# EAGLE design RGB_LED_Band_Treiber (EAGLE 4.16)

## Sheet 1 of 3
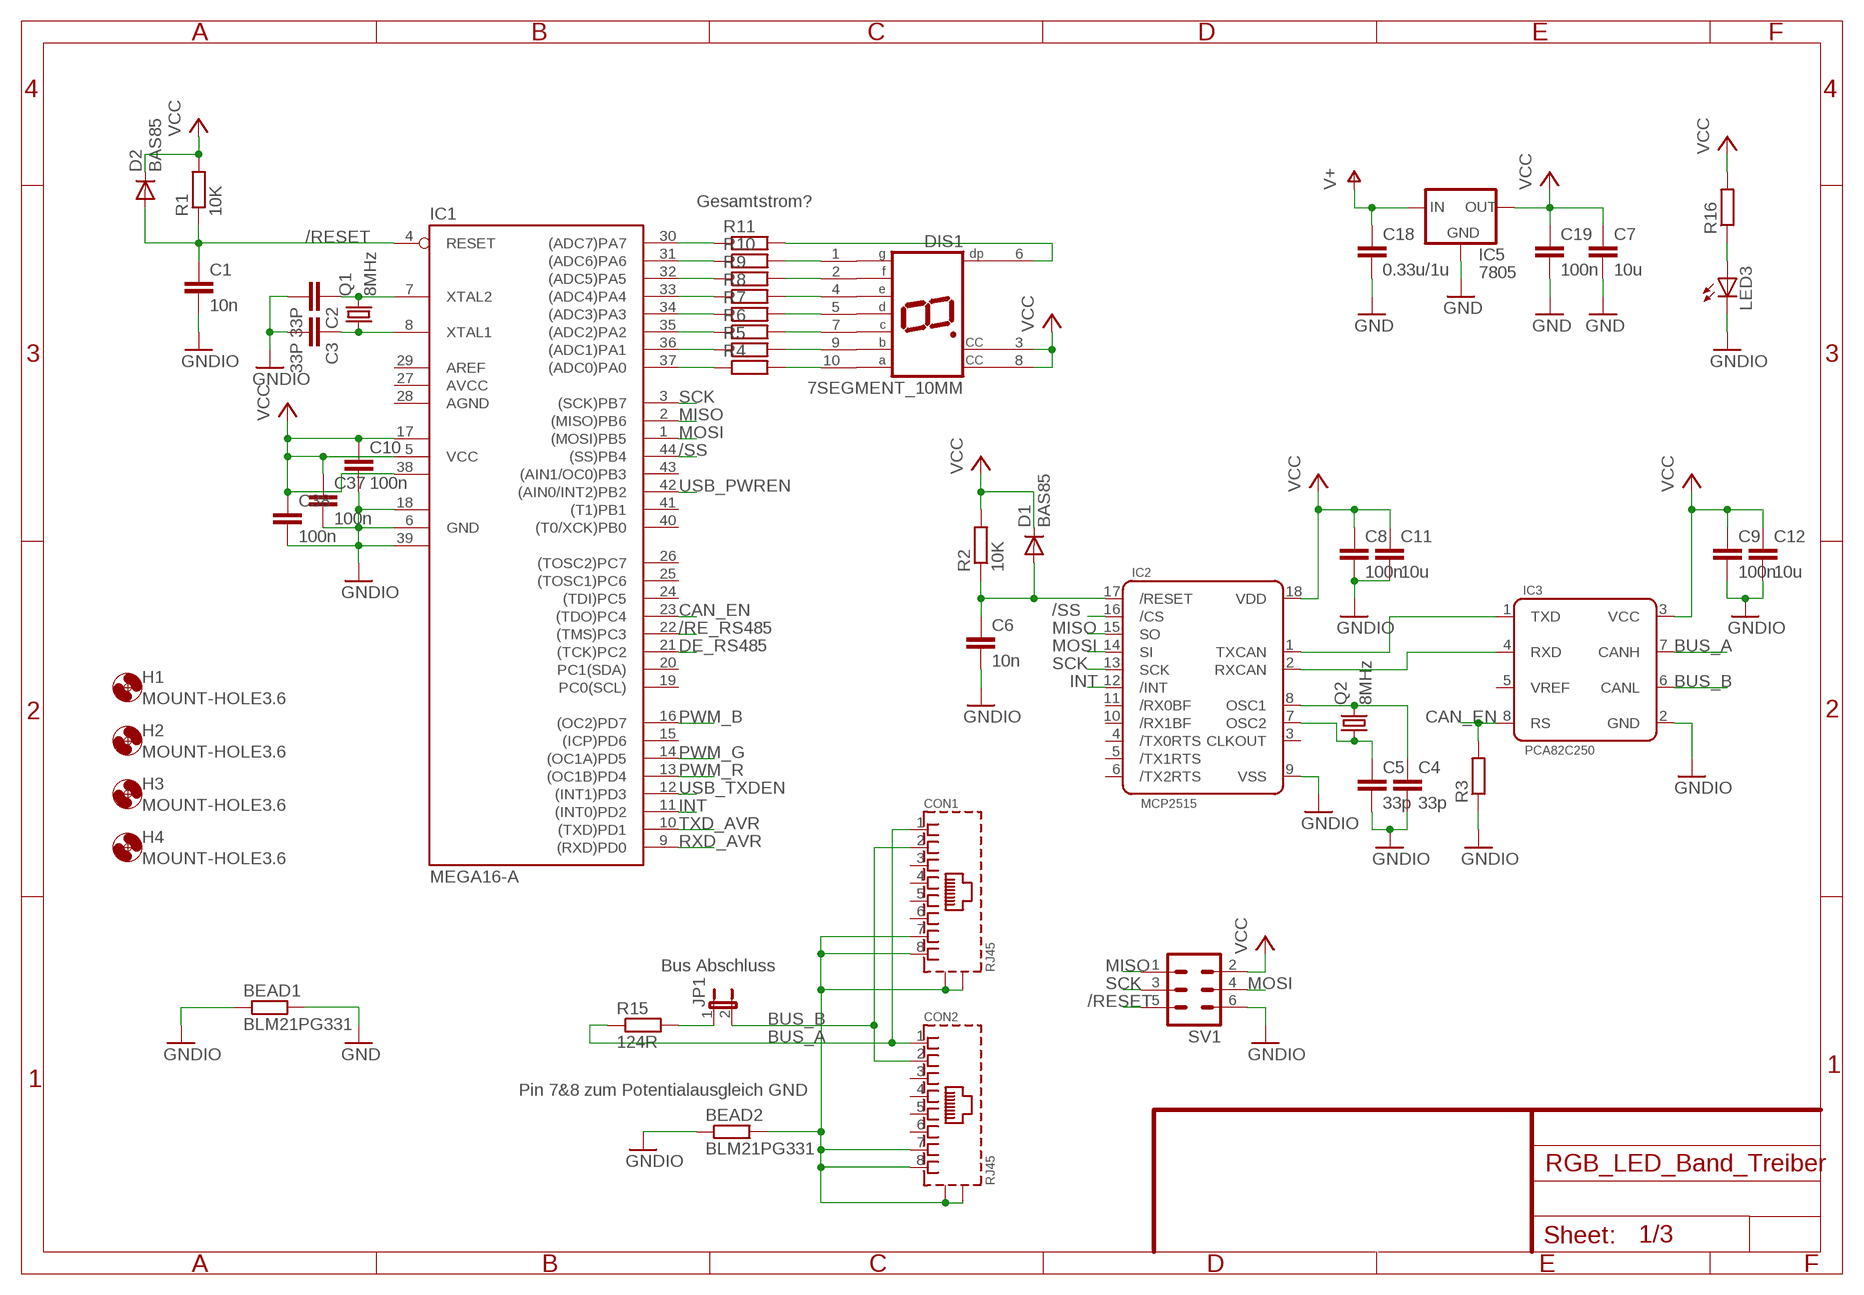
[diagram p0: schematic, sheet 1]

### Parts
BEAD1  BLM21PG331  R-EU_R0805  [R0805]
BEAD2  BLM21PG331  R-EU_R0805  [R0805]
C1  10n  C-EUC0805  [C0805]
C2  33P  C-EUC0805  [C0805]
C3  33P  C-EUC0805  [C0805]
C4  33p  C-EUC0805  [C0805]
C5  33p  C-EUC0805  [C0805]
C6  10n  C-EUC0805  [C0805]
C7  10u  C-EUC0805  [C0805]
C8  100n  C-EUC0805  [C0805]
C9  100n  C-EUC0805  [C0805]
C10  100n  C-EUC0805  [C0805]
C11  10u  C-EUC0805  [C0805]
C12  10u  C-EUC0805  [C0805]
C18  0.33u/1u  C-EUC0805  [C0805]
C19  100n  C-EUC0805  [C0805]
C37  100n  C-EUC0805  [C0805]
C38  100n  C-EUC0805  [C0805]
CON1  RJ45  [RJ45]
CON2  RJ45  [RJ45]
D1  BAS85  DIODE-SOD80C  [SOD80C]
D2  BAS85  DIODE-SOD80C  [SOD80C]
DIS1  7SEGMENT_10MM  [HDSP-E]
H1  MOUNT-HOLE3.6  [3,6]
H2  MOUNT-HOLE3.6  [3,6]
H3  MOUNT-HOLE3.6  [3,6]
H4  MOUNT-HOLE3.6  [3,6]
IC1  MEGA16-A  [TQFP44]
IC2  MCP2515  [SO18W]
IC3  PCA82C250  [SO08]
IC5  7805  78XXL  [78XXL]
JP1  JP1E  [JP1]
LED3  LEDCHIP-LED0805  [CHIP-LED0805]
Q1  8MHz  CRYTALHC49S  [HC49/S]
Q2  8MHz  CRYTALHC49S  [HC49/S]
R1  10K  R-EU_R0805  [R0805]
R2  10K  R-EU_R0805  [R0805]
R3  R-EU_R0805  [R0805]
R4  R-EU_R0805  [R0805]
R5  R-EU_R0805  [R0805]
R6  R-EU_R0805  [R0805]
R7  R-EU_R0805  [R0805]
R8  R-EU_R0805  [R0805]
R9  R-EU_R0805  [R0805]
R10  R-EU_R0805  [R0805]
R11  R-EU_R0805  [R0805]
R15  124R  R-EU_R0805  [R0805]
R16  R-EU_R0805  [R0805]
SV1  ML6  [ML6]

### Nets
/RE_RS485: IC1.22((TMS)PC3) ; also sheet 2
/RESET: C1.1 D2.A IC1.4(RESET) R1.1 SV1.5
/SS: IC1.44((SS)PB4) IC2.16(/CS)
BUS_A: CON1.1 CON2.1 IC3.7(CANH) R15.1 ; also sheet 2
BUS_B: CON1.2 CON2.2 IC3.6(CANL) JP1.2 ; also sheet 2
CAN_EN: IC1.23((TDO)PC4) IC3.8(RS) R3.2
DE_RS485: IC1.21((TCK)PC2) ; also sheet 2
GND: BEAD1.2 C7.2 C18.2 C19.2 IC5.GND ; also sheet 3
GNDIO: BEAD1.1 BEAD2.1 C1.2 C2.2 C3.2 C4.2 C5.2 C6.2 C8.2 C9.2 C10.2 C11.2 C12.2 C37.2 C38.2 IC1.6(GND) IC1.18(GND1) IC1.39(GND2) IC2.9(VSS) IC3.2(GND) LED3.C R3.1 SV1.6 ; also sheet 2
INT: IC1.11((INT0)PD2) IC2.12(/INT)
MISO: IC1.2((MISO)PB6) IC2.15(SO) SV1.1
MOSI: IC1.1((MOSI)PB5) IC2.14(SI) SV1.4
N$1: C3.1 IC1.8(XTAL1) Q1.1
N$2: C2.1 IC1.7(XTAL2) Q1.2
N$3: C6.1 D1.A IC2.17(/RESET) R2.1
N$4: C4.1 IC2.8(OSC1) Q2.2
N$5: C5.1 IC2.7(OSC2) Q2.1
N$6: IC1.37((ADC0)PA0) R4.1
N$7: IC2.1(TXCAN) IC3.1(TXD)
N$8: IC2.2(RXCAN) IC3.4(RXD)
N$10: IC1.36((ADC1)PA1) R5.1
N$11: IC1.35((ADC2)PA2) R6.1
N$12: IC1.34((ADC3)PA3) R7.1
N$13: IC1.33((ADC4)PA4) R8.1
N$14: IC1.32((ADC5)PA5) R9.1
N$15: IC1.31((ADC6)PA6) R10.1
N$16: IC1.30((ADC7)PA7) R11.1
N$17: DIS1.10(A) R4.2
N$18: DIS1.9(B) R5.2
N$19: DIS1.7(C) R6.2
N$20: DIS1.5(D) R7.2
N$21: DIS1.4(E) R8.2
N$22: DIS1.2(F) R9.2
N$23: DIS1.1(G) R10.2
N$24: DIS1.6(DP) R11.2
N$27: JP1.1 R15.2
N$37: LED3.A R16.1
N$38: BEAD2.2 CON1.7 CON1.8 CON1.SHIELD1(GND1) CON1.SHILD2(GND2) CON2.7 CON2.8 CON2.SHIELD1(GND1) CON2.SHILD2(GND2)
PWM_B: IC1.16((OC2)PD7) ; also sheet 3
PWM_G: IC1.14((OC1A)PD5) ; also sheet 3
PWM_R: IC1.13((OC1B)PD4) ; also sheet 3
RXD_AVR: IC1.9((RXD)PD0) ; also sheet 2
SCK: IC1.3((SCK)PB7) IC2.13(SCK) SV1.3
TXD_AVR: IC1.10((TXD)PD1) ; also sheet 2
USB_PWREN: IC1.42((AIN0/INT2)PB2) ; also sheet 2
USB_TXDEN: IC1.12((INT1)PD3) ; also sheet 2
V+: C18.1 IC5.IN ; also sheet 3
VCC: C7.1 C8.1 C9.1 C10.1 C11.1 C12.1 C19.1 C37.1 C38.1 D1.C D2.C DIS1.3(CC) DIS1.8(CC) IC1.5(VCC) IC1.17(VCC1) IC1.38(VCC2) IC2.18(VDD) IC3.3(VCC) IC5.OUT R1.2 R2.2 R16.2 SV1.2 ; also sheet 2
Unconnected: CON1.3 CON1.4 CON1.5 CON1.6 CON2.3 CON2.4 CON2.5 CON2.6 IC1.15((ICP)PD6) IC1.19(PC0(SCL)) IC1.20(PC1(SDA)) IC1.24((TDI)PC5) IC1.25((TOSC1)PC6) IC1.26((TOSC2)PC7) IC1.40((T0/XCK)PB0) IC1.41((T1)PB1) IC1.43((AIN1/OC0)PB3) IC2.3(CLKOUT) IC2.4(/TX0RTS) IC2.5(/TX1RTS) IC2.6(/TX2RTS) IC2.10(/RX1BF) IC2.11(/RX0BF) IC3.5(VREF)

### Notes on the sheet
- Gesamtstrom?
- Bus Abschluss
- Pin 7&8 zum Potentialausgleich GND

## Sheet 2 of 3
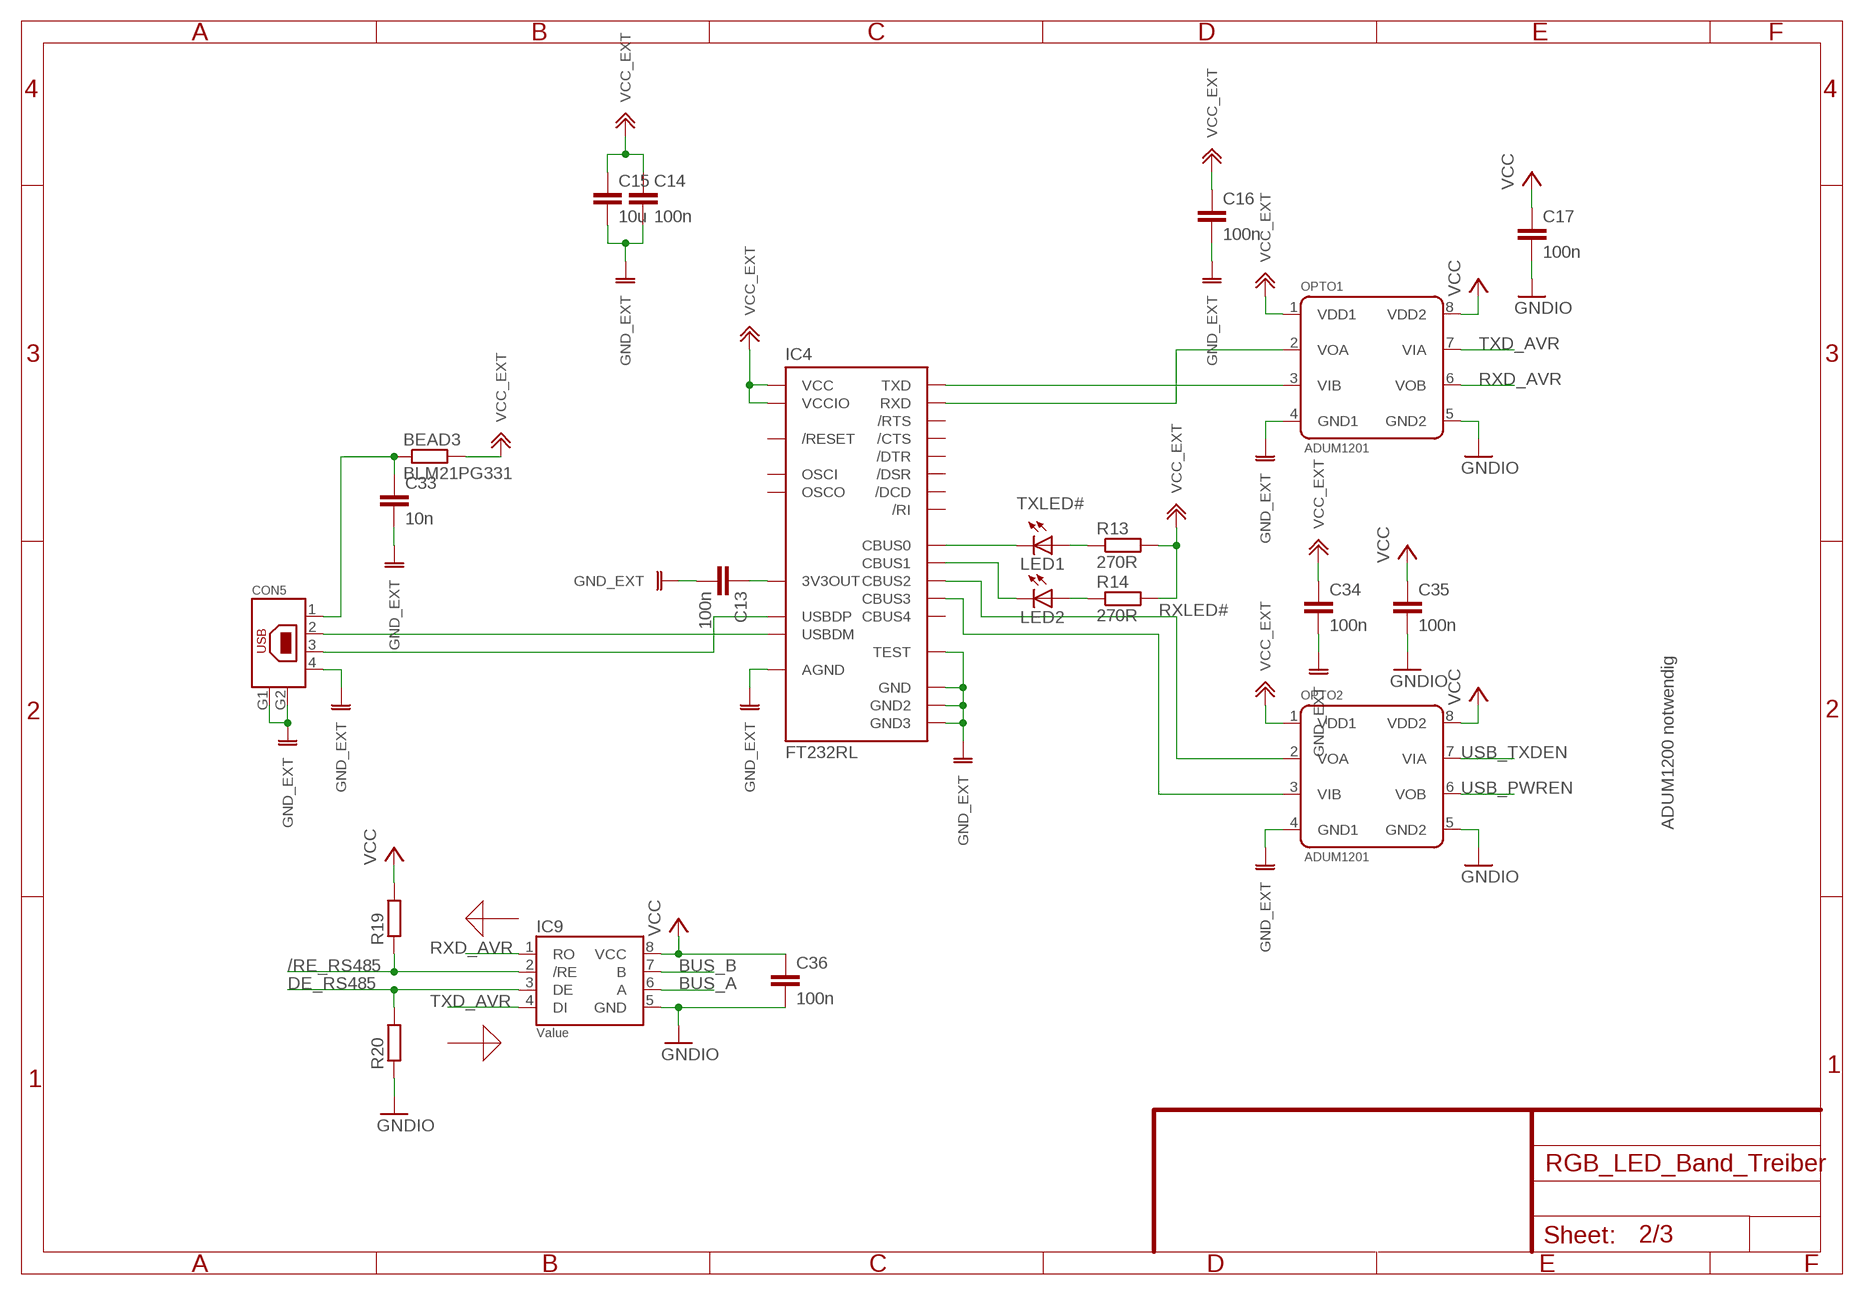
[diagram p1: schematic, sheet 2]

### Parts
BEAD3  BLM21PG331  R-EU_R0805  [R0805]
C13  100n  C-EUC0805  [C0805]
C14  100n  C-EUC0805  [C0805]
C15  10u  C-EUC0805  [C0805]
C16  100n  C-EUC0805  [C0805]
C17  100n  C-EUC0805  [C0805]
C33  10n  C-EUC0805  [C0805]
C34  100n  C-EUC0805  [C0805]
C35  100n  C-EUC0805  [C0805]
C36  100n  C-EUC0805  [C0805]
CON5  USB_TYPB_PCB  [USB_LUMBERG_241102]
IC4  FT232RL  [SSOP28]
IC9  LT1785  [SO08]
LED1  LEDCHIPLED_0805  [CHIPLED_0805]
LED2  LEDCHIPLED_0805  [CHIPLED_0805]
OPTO1  ADUM1201  [SO08]
OPTO2  ADUM1201  [SO08]
R13  270R  R-EU_R0805  [R0805]
R14  270R  R-EU_R0805  [R0805]
R19  R-EU_R0805  [R0805]
R20  R-EU_R0805  [R0805]

### Nets
/RE_RS485: IC9.2(/RE) R19.1 ; also sheet 1
BUS_A: IC9.6(A) ; also sheet 1
BUS_B: IC9.7(B) ; also sheet 1
DE_RS485: IC9.3(DE) R20.2 ; also sheet 1
GND_EXT: C13.2 C14.2 C15.2 C16.2 C33.2 C34.2 CON5.4 CON5.G1 CON5.G2 IC4.P$7(GND) IC4.P$18(GND2) IC4.P$21(GND3) IC4.P$25(AGND) IC4.P$26(TEST) OPTO1.4(GND1) OPTO2.4(GND1)
GNDIO: C17.2 C35.2 C36.2 IC9.5(GND) OPTO1.5(GND2) OPTO2.5(GND2) R20.1 ; also sheet 1
N$9: BEAD3.1 C33.1 CON5.1
N$25: CON5.2 IC4.P$16(USBDM)
N$26: C13.1 IC4.P$17(3V3OUT)
N$29: LED1.A R13.1
N$30: LED2.A R14.1
N$31: IC4.P$23(CBUS0) LED1.C
N$32: IC4.P$22(CBUS1) LED2.C
N$33: IC4.P$1(TXD) OPTO1.3(VIB)
N$34: IC4.P$5(RXD) OPTO1.2(VOA)
N$40: CON5.3 IC4.P$15(USBDP)
N$42: IC4.P$13(CBUS2) OPTO2.2(VOA)
N$46: IC4.P$14(CBUS3) OPTO2.3(VIB)
RXD_AVR: IC9.1(RO) OPTO1.6(VOB) ; also sheet 1
TXD_AVR: IC9.4(DI) OPTO1.7(VIA) ; also sheet 1
USB_PWREN: OPTO2.6(VOB) ; also sheet 1
USB_TXDEN: OPTO2.7(VIA) ; also sheet 1
VCC: C17.1 C35.1 C36.1 IC9.8(VCC) OPTO1.8(VDD2) OPTO2.8(VDD2) R19.2 ; also sheet 1
VCC_EXT: BEAD3.2 C14.1 C15.1 C16.1 C34.1 IC4.P$4(VCCIO) IC4.P$20(VCC) OPTO1.1(VDD1) OPTO2.1(VDD1) R13.2 R14.2
Unconnected: IC4.P$2(/DTR) IC4.P$3(/RTS) IC4.P$6(/RI) IC4.P$9(/DSR) IC4.P$10(/DCD) IC4.P$11(/CTS) IC4.P$12(CBUS4) IC4.P$19(/RESET) IC4.P$27(OSCI) IC4.P$28(OSCO)

### Notes on the sheet
- TXLED#
- RXLED#
- ADUM1200 notwendig

## Sheet 3 of 3
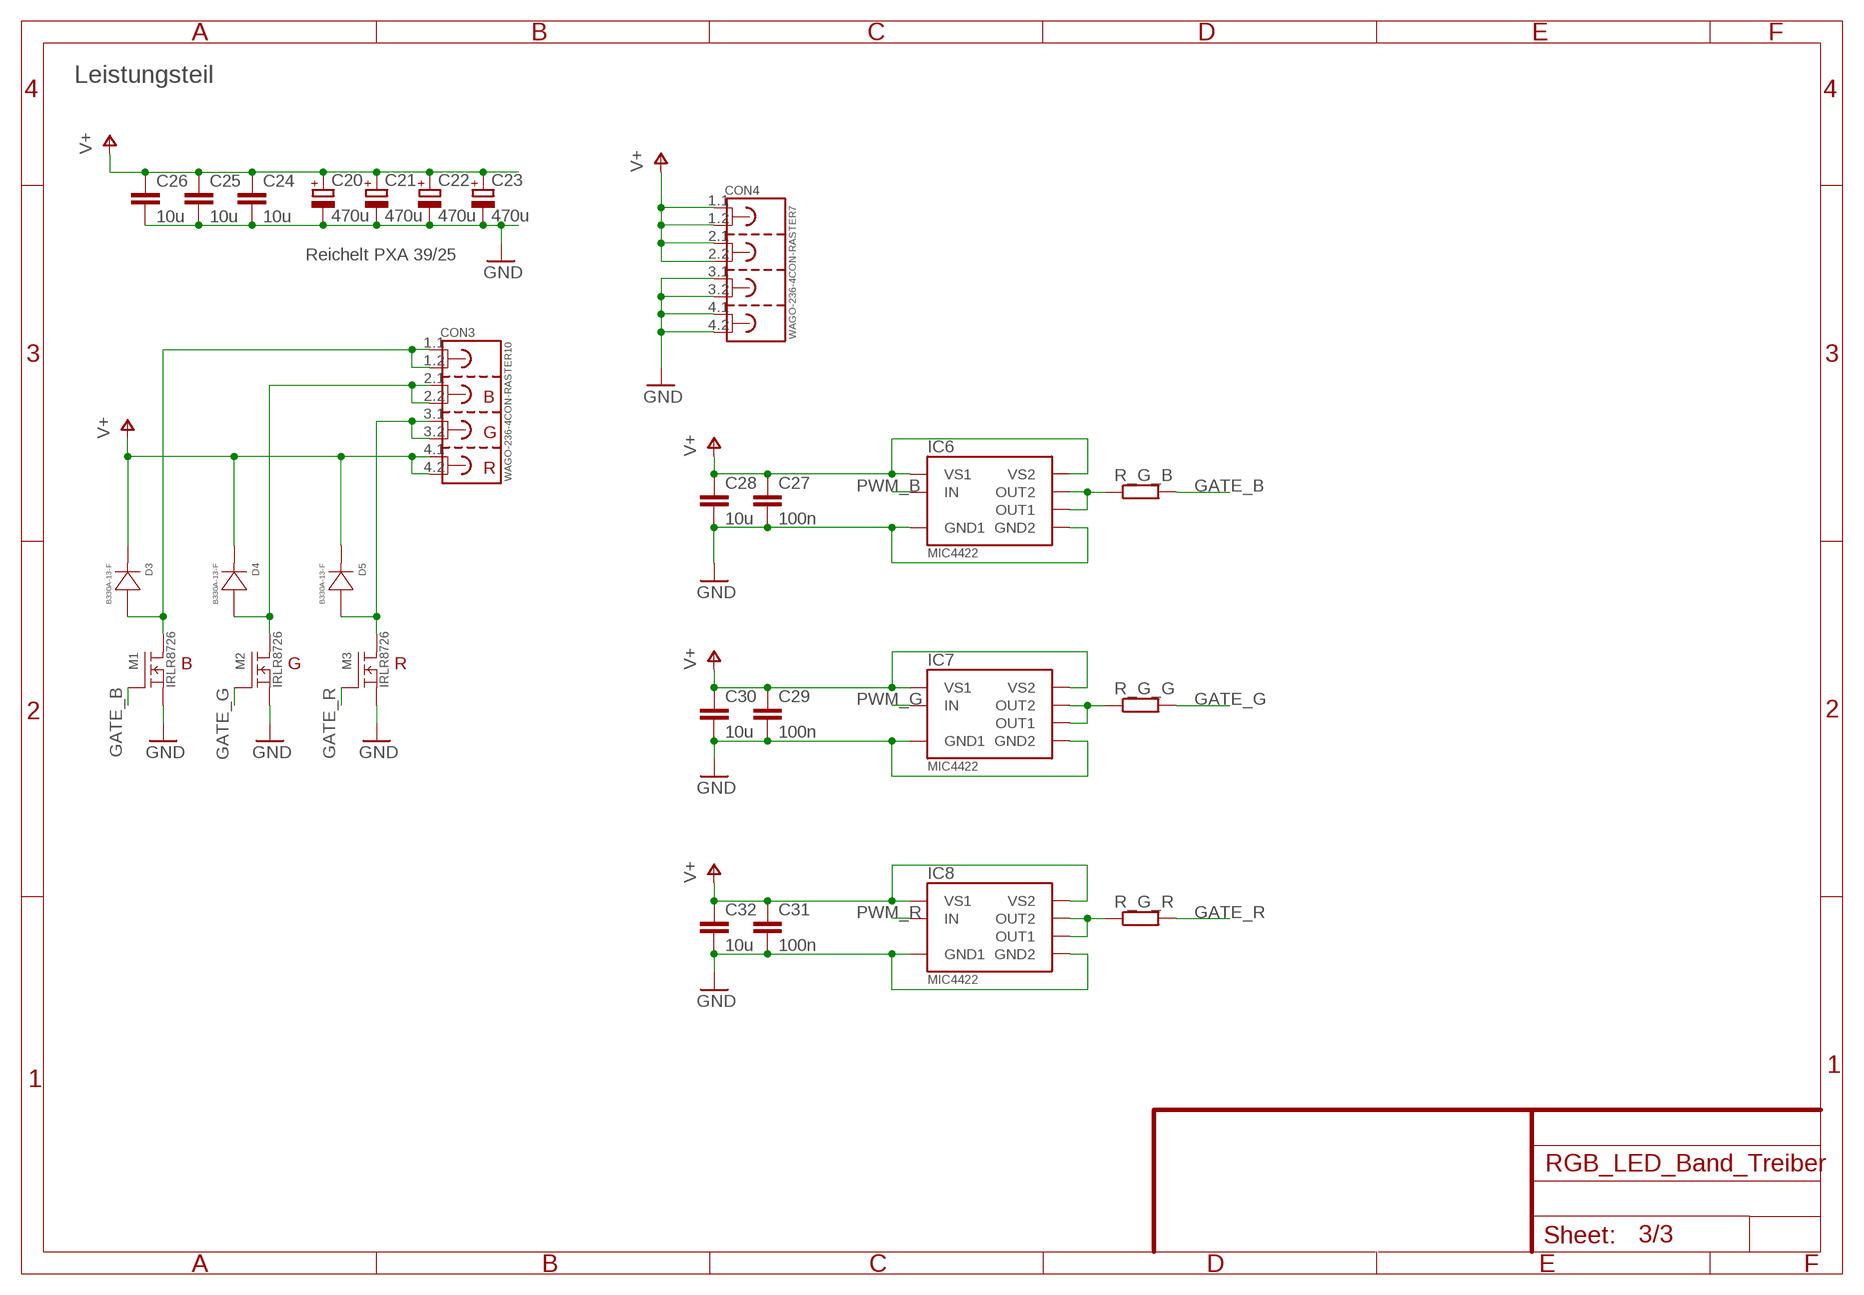
[diagram p2: schematic, sheet 3]

### Parts
C20  470u  CPOL-EUE5-10.5  [E5-10,5]
C21  470u  CPOL-EUE5-10.5  [E5-10,5]
C22  470u  CPOL-EUE5-10.5  [E5-10,5]
C23  470u  CPOL-EUE5-10.5  [E5-10,5]
C24  10u  C-EUC0805  [C0805]
C25  10u  C-EUC0805  [C0805]
C26  10u  C-EUC0805  [C0805]
C27  100n  C-EUC0805  [C0805]
C28  10u  C-EUC0805  [C0805]
C29  100n  C-EUC0805  [C0805]
C30  10u  C-EUC0805  [C0805]
C31  100n  C-EUC0805  [C0805]
C32  10u  C-EUC0805  [C0805]
CON3  WAGO-236-4CON-RASTER10  [WAGO236_10_4]
CON4  WAGO-236-4CON-RASTER7  [WAGO236_7.5_4]
D3  B330A-13-F  [SMA]
D4  B330A-13-F  [SMA]
D5  B330A-13-F  [SMA]
IC6  MIC4422  [SO08]
IC7  MIC4422  [SO08]
IC8  MIC4422  [SO08]
M1  IRLR8726  [D-PAK]
M2  IRLR8726  [D-PAK]
M3  IRLR8726  [D-PAK]
R_G_B  R-EU_R0805  [R0805]
R_G_G  R-EU_R0805  [R0805]
R_G_R  R-EU_R0805  [R0805]

### Nets
GATE_B: M1.G R_G_B.2
GATE_G: M2.G R_G_G.2
GATE_R: M3.G R_G_R.2
GND: C20.- C21.- C22.- C23.- C24.2 C25.2 C26.2 C27.2 C28.2 C29.2 C30.2 C31.2 C32.2 CON4.3.1 CON4.3.2 CON4.4.1 CON4.4.2 IC6.4(GND1) IC6.5(GND2) IC7.4(GND1) IC7.5(GND2) IC8.4(GND1) IC8.5(GND2) M1.S M2.S M3.S ; also sheet 1
N$28: CON3.3.1 CON3.3.2 D5.A M3.D
N$36: CON3.1.1 CON3.1.2 D3.A M1.D
N$43: IC6.6(OUT1) IC6.7(OUT2) R_G_B.1
N$44: IC8.6(OUT1) IC8.7(OUT2) R_G_R.1
N$45: IC7.6(OUT1) IC7.7(OUT2) R_G_G.1
N_B: CON3.2.1 CON3.2.2 D4.A M2.D
PWM_B: IC6.2(IN) ; also sheet 1
PWM_G: IC7.2(IN) ; also sheet 1
PWM_R: IC8.2(IN) ; also sheet 1
V+: C20.+ C21.+ C22.+ C23.+ C24.1 C25.1 C26.1 C27.1 C28.1 C29.1 C30.1 C31.1 C32.1 CON3.4.1 CON3.4.2 CON4.1.1 CON4.1.2 CON4.2.1 CON4.2.2 D3.K D4.K D5.K IC6.1(VS1) IC6.8(VS2) IC7.1(VS1) IC7.8(VS2) IC8.1(VS1) IC8.8(VS2) ; also sheet 1

### Notes on the sheet
- Leistungsteil
- Reichelt PXA 39/25
- B
- G
- R
- B | G | R

## Power pins joined to a net without a drawn wire
AGND: IC1.28(AGND)
AREF: IC1.29(AREF)
AVCC: IC1.27(AVCC)

## Library data of the parts
BEAD1-BEAD3 R1-R11 R13-R16 R19 R20 R_G_B R_G_G R_G_R = rcl:R-EU_: RESISTOR, European symbol
C1-C19 C24-C38 = rcl:C-EU: CAPACITOR, European symbol
C20-C23 = rcl:CPOL-EU: POLARIZED CAPACITOR, European symbol
CON1 CON2 = marcus:RJ45: RJ45 Platinen-Buchse TE Connectivity Farnell Bestellnummer: 2059750 Created by Marcus Knips 9/2012
CON3 CON4 = marcus:WAGO-236-4CON-*
CON5 = marcus:USB_TYPB_PCB: UBS Einbaukupplung Typ B lumberg Artikelnummer: 241102 Created by Marcus Knips 1/2013
D1 D2 = diode:DIODE-: DIODE
D3-D5 = marcus:B330A-13-F: B330A-13-F Schottky Diode DIODES Incorporated Vr = 30V, Id = 3A / 80A pulse Created by Marcus Knips 9/2012
DIS1 = marcus:7SEGMENT_10MM: LED DISPLAY 1-character 7 segment, decimal point right Knigbright SA39-11, SA39-12, SC39-11, SC39-12 Device creaded by Marcus Knips 1/2012
H1-H4 = holes:MOUNT-HOLE: MOUNTING HOLE with drill center marker
IC1 = atmel:MEGA16: MICROCONTROLLER 16 Kbytes FLASH 1 kbytes SRAM 512 bytes EEPROM USART 8-channel 10 bit ADC Source: avr.lbr
IC2 = marcus:MCP2515: MCP2515 CAN Controller Stand-Alone CAN Controller with SPI Interface Microchip Created by Marcus Knips Jan. 2012
IC3 = marcus:PCA82C250: CAN Driver PCA25C250 Philips Creaded by Marcus Knips 1/2012
IC4 = marcus:FT232RL: FT232RL USB USRT FTDI Chip Created by Marcus Knips 1/2012
IC5 = v-reg:78XXL: VOLTAGE REGULATOR
IC6-IC8 = marcus:MIC4422: MIC4422 9A-Peak Low-Side MOSFET Driver micrel&reg Created by Marcus Knips 11/2012
IC9 = marcus:LT1785: LT1785 RS-485 Transceiver Linear Technology Ceated by Marcus Knips 11/2012
JP1 = jumper:JP1E: JUMPER
LED1-LED3 = led:LED: LED OSRAM: - CHIPLED LG R971, LG N971, LY N971, LG Q971, LY Q971, LO R971, LY R971 LH N974, LH R974 LS Q976, LO Q976, LY Q976 LO Q996 - Hyper CHIPLED LW Q18S LB Q993, LB Q99A, LB R99A - SideLED LS A670, LO A670, LY A670, LG A670, LP A670 LB A673, LV A673, LT A673, LW A673 LH A674 LY A675 LS A676, LA A676, LO A676, LY A676, LW A676 LS A679, LY A679, LG A679 - Hyper Micro SIDELED® LS Y876, LA Y876, LO Y876, LY Y876 LT Y87S - SmartLED LW L88C, LW L88S LB L89C, LB L89S, LG L890 LS L89K, LO L89K, LY L89K LS L896, LA L896, LO L896, LY L896 - TOPLED LS T670, LO T670, LY T670, LG T670, LP T670 LSG T670, LSP T670, LSY T670, LOP T670, LYG T670 LG T671, LOG T671, LSG T671 LB T673, LV T673, LT T673, LW T673 LH T674 LS T676, LA T676, LO T676, LY T676, LB T676, LH T676, LSB T676, LW T676 LB T67C, LV T67C, LT T67C, LS T67K, LO T67K, LY T67K, LW E67C LS E67B, LA E67B, LO E67B, LY E67B, LB E67C, LV E67C, LT E67C LW T67C LS T679, LY T679, LG T679 LS T770, LO T770, LY T770, LG T770, LP T770 LB T773, LV T773, LT T773, LW T773 LH T774 LS E675, LA E675, LY E675, LS T675 LS T776, LA T776, LO T776, LY T776, LB T776 LHGB T686 LT T68C, LB T68C - Hyper Mini TOPLED® LB M676 - Mini TOPLED Santana® LG M470 LS M47K, LO M47K, LY M47K Source: http://www.osram.convergy.de/
M1-M3 = marcus:IRLR8726: IRLR8726 HEXFET Power MOSFET International Recifier Vdss = 30V, Id = 86A, Rds(on) = 5,8mOhm Farnell Bestellnummer: 1698305 Created by Marcus Knips 9/2012
OPTO1 OPTO2 = marcus:ADUM1201: ADuM1201 Dual-Canel-Digital Isolator Analog Devices Created by Marcus Knips 1/2012
Q1 Q2 = crystal:CRYTAL: CRYSTAL
SV1 = con-harting-ml:ML6: HARTING

## Board
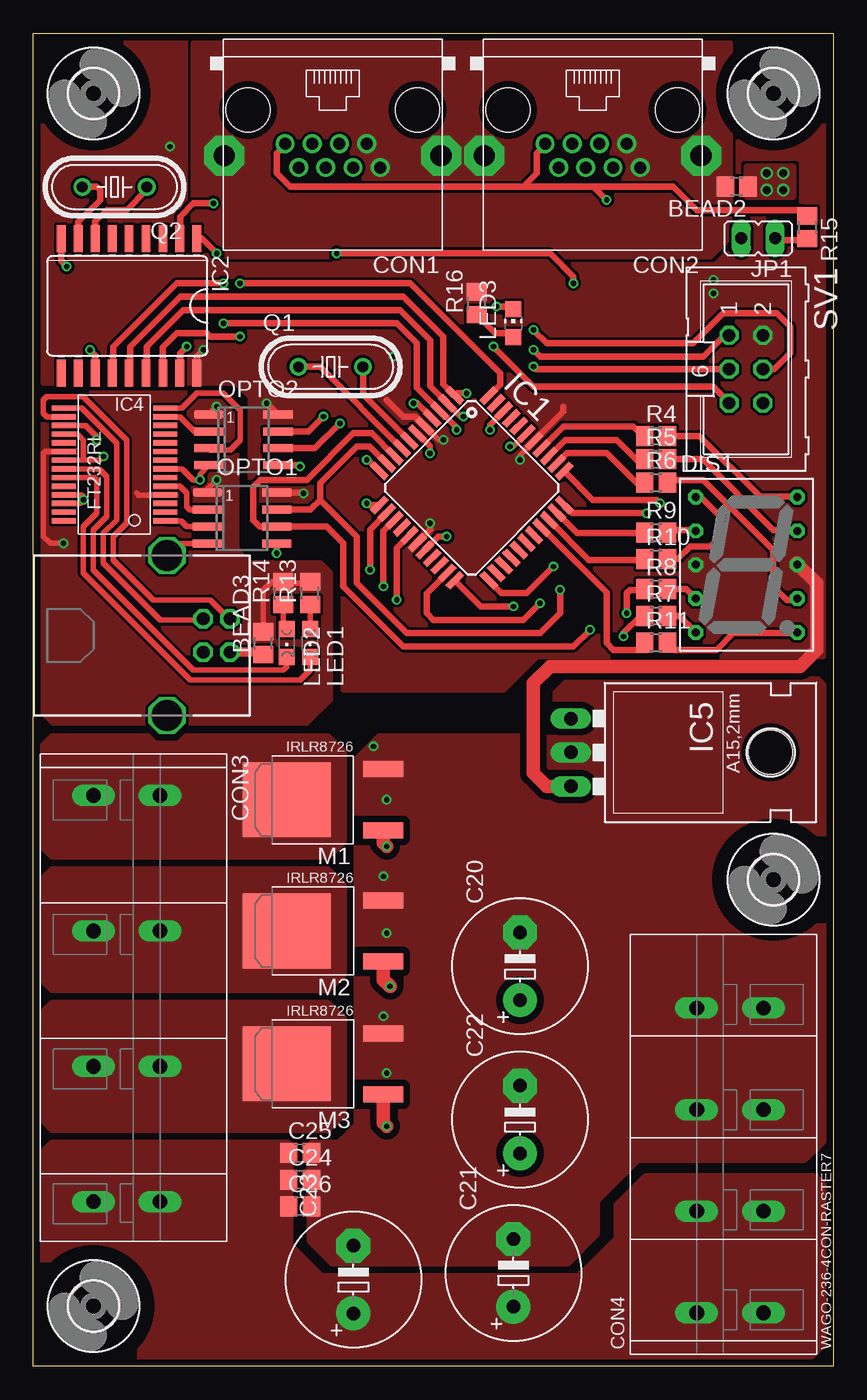
[diagram p3: board, top side]
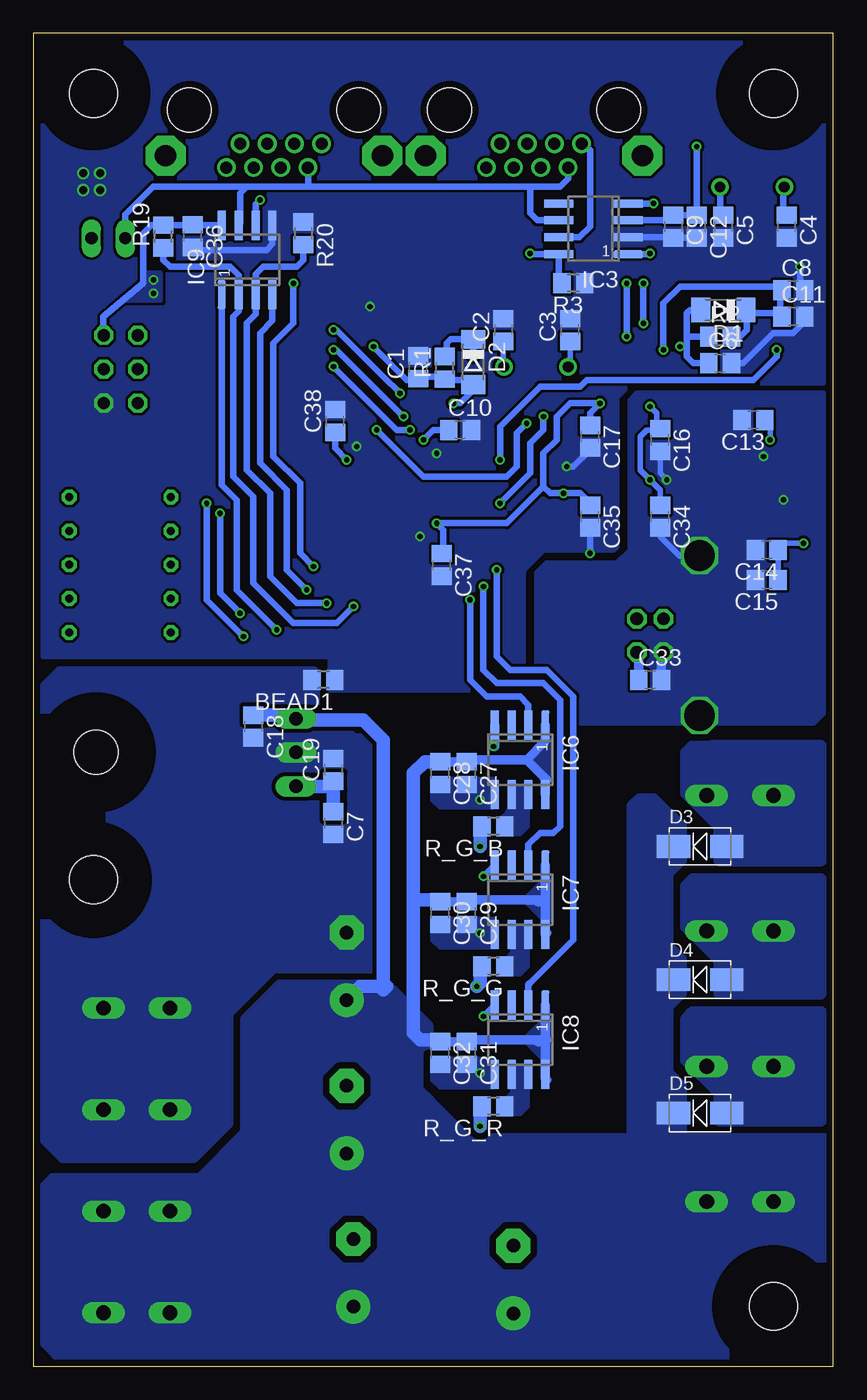
[diagram p4: board, bottom side, seen from below]

Size 60 x 100 mm. Coordinates in mm from the lower left corner, seen from the top.
Outline: 0,0 0,100 60,100 60,0 0,0
Copper layers (1*16): Top 0.035mm / dielectric 1.5mm / Bottom 0.035mm
Design rules "multi-cb_035um-cu": minimum track width 5mil, minimum drill 3mil, track to track 8mil, track to pad 8mil, pad to pad 8mil, via to via 8mil, smd to smd 1mil, copper to edge 20mil, drill to drill 10mil, minimum pad ring 10mil, minimum via ring 6mil, stop-mask expansion 3mil, vias tented up to drill 0mil, thermal gap 8mil

### Footprints (pad centres in the part's own frame; a part is rotated, then mirrored left to right if it is on the bottom)
R0805 = smd 1.3 x 1.5: 1 -0.85,0; 2 0.85,0
C0805 = smd 1.3 x 1.5: 1 -0.85,0; 2 0.85,0
E5-10,5 = drill 1.016 pad 2.54 round: + -2.54,0 | drill 1.016 pad 2.54 octagon: - 2.54,0
RJ45 = drill 0.9 round: 1 3.57,2.54; 2 2.55,4.32; 3 1.53,2.54; 4 0.51,4.32; 5 -0.51,2.54; 6 -1.53,4.32; 7 -2.55,2.54; 8 -3.57,4.32 | drill 1.6 pad 3 octagon: SHIELD1 -8.13,3.43; SHILD2 8.13,3.43 | hole 3.3: -6.35,0; 6.35,0
WAGO236_10_4 = drill 1.1 long: 1.1 -20.32,0; 1.2 -20.32,-5; 2.1 -10.16,0; 2.2 -10.16,-5; 3.1 0,0; 3.2 0,-5; 4.1 10.16,0; 4.2 10.16,-5
WAGO236_7.5_4 = drill 1.1 long: 1.1 -15.24,0; 1.2 -15.24,-5; 2.1 -7.62,0; 2.2 -7.62,-5; 3.1 0,0; 3.2 0,-5; 4.1 7.62,0; 4.2 7.62,-5
USB_LUMBERG_241102 = drill 0.95 octagon: 1 1.25,4.71; 2 -1.25,4.71; 3 -1.25,2.71; 4 1.25,2.71 | drill 2.3 octagon: G1 -6,0; G2 6,0
SOD80C = smd 1.4 x 1.8: A 1.7,0; C -1.7,0
SMA = smd 2.5 x 1.7: A 2,0; K -2,0
HDSP-E = drill 0.6 octagon: 1 -3.81,5.08; 2 -3.81,2.54; 3 -3.81,0; 4 -3.81,-2.54; 5 -3.81,-5.08; 6 3.81,-5.08; 7 3.81,-2.54; 8 3.81,0; 9 3.81,2.54; 10 3.81,5.08
3,6 = hole 3.6: 0,0
TQFP44 = smd 1.5 x 0.5: 1 -5.8,4; 2 -5.8,3.2; 3 -5.8,2.4; 4 -5.8,1.6; 5 -5.8,0.8; 6 -5.8,0; 7 -5.8,-0.8; 8 -5.8,-1.6; 9 -5.8,-2.4; 10 -5.8,-3.2; 11 -5.8,-4; 23 5.8,-4; 24 5.8,-3.2; 25 5.8,-2.4; 26 5.8,-1.6; 27 5.8,-0.8; 28 5.8,0; 29 5.8,0.8; 30 5.8,1.6; 31 5.8,2.4; 32 5.8,3.2; 33 5.8,4 | smd 0.5 x 1.5: 12 -4,-5.8; 13 -3.2,-5.8; 14 -2.4,-5.8; 15 -1.6,-5.8; 16 -0.8,-5.8; 17 0,-5.8; 18 0.8,-5.8; 19 1.6,-5.8; 20 2.4,-5.8; 21 3.2,-5.8; 22 4,-5.8; 34 4,5.8; 35 3.2,5.8; 36 2.4,5.8; 37 1.6,5.8; 38 0.8,5.8; 39 0,5.8; 40 -0.8,5.8; 41 -1.6,5.8; 42 -2.4,5.8; 43 -3.2,5.8; 44 -4,5.8
SO18W = smd 0.66 x 2.032: 1 -5.08,-5.029; 2 -3.81,-5.029; 3 -2.54,-5.029; 4 -1.27,-5.029; 5 0,-5.029; 6 1.27,-5.029; 7 2.54,-5.029; 8 3.81,-5.029; 9 5.08,-5.029; 10 5.08,5.029; 11 3.81,5.029; 12 2.54,5.029; 13 1.27,5.029; 14 0,5.029; 15 -1.27,5.029; 16 -2.54,5.029; 17 -3.81,5.029; 18 -5.08,5.029
SO08 = smd 0.6 x 2.2: 1 -1.905,-2.6; 2 -0.635,-2.6; 3 0.635,-2.6; 4 1.905,-2.6; 5 1.905,2.6; 6 0.635,2.6; 7 -0.635,2.6; 8 -1.905,2.6
SSOP28 = smd 1.8 x 0.4: P$1 -3.8,4.225; P$2 -3.8,3.575; P$3 -3.8,2.925; P$4 -3.8,2.275; P$5 -3.8,1.625; P$6 -3.8,0.975; P$7 -3.8,0.325; P$8 -3.8,-0.325; P$9 -3.8,-0.975; P$10 -3.8,-1.625; P$11 -3.8,-2.275; P$12 -3.8,-2.925; P$13 -3.8,-3.575; P$14 -3.8,-4.225; P$15 3.8,-4.225; P$16 3.8,-3.575; P$17 3.8,-2.925; P$18 3.8,-2.275; P$19 3.8,-1.625; P$20 3.8,-0.975; P$21 3.8,-0.325; P$22 3.8,0.325; P$23 3.8,0.975; P$24 3.8,1.625; P$25 3.8,2.275; P$26 3.8,2.925; P$27 3.8,3.575; P$28 3.8,4.225
78XXL = drill 1.016 long: GND 0,-3.81; IN -2.54,-3.81; OUT 2.54,-3.81 | hole 3.302: 0,11.176
JP1 = drill 0.914 long: 1 0,-1.27; 2 0,1.27
CHIPLED_0805 = smd 1.2 x 1.2: A 0,-1.05; C 0,1.05
CHIP-LED0805 = smd 1.2 x 1.2: A 0,-1.05; C 0,1.05
D-PAK = smd 5.6 x 6.6: D 0,5 | smd 1.2 x 3: G -2.29,-2.24; S 2.29,-2.24
HC49/S = drill 0.813 round: 1 -2.413,0; 2 2.413,0
ML6 = drill 0.914 octagon: 1 -2.54,-1.27; 2 -2.54,1.27; 3 0,-1.27; 4 0,1.27; 5 2.54,-1.27; 6 2.54,1.27

### Placement (x,y rotation side)
BEAD1  38.25,51.5 180 bottom
BEAD2  52.75,88.5 180 top
BEAD3  17.25,54.25 90 top
C1  31.15,74.95 90 bottom
C2  24.75,77.75 90 bottom
C3  19.75,77.75 90 bottom
C4  3.5,85.5 270 bottom
C5  8.25,85.5 270 bottom
C6  8.5,75.25 0 bottom
C7  37.5,40.75 270 bottom
C8  3,80.75 0 bottom
C9  12,85.5 270 bottom
C10  28,70.25 0 bottom
C11  3,78.75 0 bottom
C12  10.25,85.5 270 bottom
C13  6,71 180 bottom
C14  5,61.25 180 bottom
C15  5,59 180 bottom
C16  13,69.5 270 bottom
C17  18.25,69.75 270 bottom
C18  43.5,48 270 bottom
C19  37.5,44.75 90 bottom
C20  36.5,30 90 top
C21  36,7 90 top
C22  36.5,18.5 90 top
C23  24,6.5 90 top
C24  20,14 0 top
C25  20,16 0 top
C26  20,12 0 top
C27  27.5,44.5 270 bottom
C28  29.5,44.5 270 bottom
C29  27.5,34 270 bottom
C30  29.5,34 270 bottom
C31  27.5,23.5 270 bottom
C32  29.5,23.5 270 bottom
C33  13.75,51.5 0 bottom
C34  13,63.75 270 bottom
C35  18.25,63.75 270 bottom
C36  48.05,84.8 270 bottom
C37  29.37,60.12 270 bottom
C38  37.37,70.92 90 bottom
CON1  22.45,94.25 180 top
CON2  41.95,94.25 180 top
CON3  9.5,22.5 270 top
CON4  49.75,19.25 90 top
CON5  10.03,54.82 270 top
D1  8.25,79.25 180 bottom
D2  27,75.35 270 bottom
D3  10,39 0 bottom
D4  10,29 0 bottom
D5  10,19 0 bottom
DIS1  53.49,60.13 0 top
H1  4.5,4.5 0 top
H2  55.5,36.5 0 top
H3  4.5,95.5 0 top
H4  55.5,95.5 0 top
IC1  32.88,65.89 315 top
IC2  7.18,79.55 180 top
IC3  17.99,85.33 90 bottom
IC4  6.08,67.65 180 top
IC5  44.12,46.05 270 top
IC6  23.5,45.5 180 bottom
IC7  23.5,35 180 bottom
IC8  23.5,24.5 180 bottom
IC9  43.97,83 0 bottom
JP1  54.37,84.62 90 top
LED1  20.75,54.25 180 top
LED2  19,54.25 180 top
LED3  36,78.25 0 top
M1  24,42.5 90 top
M2  24.02,32.66 90 top
M3  24.02,22.69 90 top
OPTO1  15.66,63.64 270 top
OPTO2  15.75,69.5 270 top
Q1  22.3,74.98 0 top
Q2  6.09,88.47 180 top
R1  29.15,74.9 90 bottom
R2  8.5,77.25 0 bottom
R3  19.5,81.25 180 bottom
R4  46.7,69.8 0 top
R5  46.7,68.05 0 top
R6  46.7,66.3 0 top
R7  46.7,56.3 0 top
R8  46.7,58.3 0 top
R9  46.7,62.55 0 top
R10  46.7,60.55 0 top
R11  46.7,54.3 0 top
R13  20.75,58 90 top
R14  18.75,58 90 top
R15  58.05,85.45 270 top
R16  33.25,79.75 90 top
R19  50.25,84.75 90 bottom
R20  39.75,85 270 bottom
R_G_B  25.5,40.5 180 bottom
R_G_G  25.5,30 180 bottom
R_G_R  25.5,19.5 180 bottom
SV1  53.45,74.8 270 top

### Tracks (layer width: path | path; a pad name or v marks a point on that pad's centre or on a via)
/RE_RS485  (via drill 0.4)
  Top 0.5: IC1.22 33.57,57 v36,57
  Bottom 0.5: R19.1 50.25,83 49.75,82.5 45.25,82.5 44.6,81.86 IC9.2 44.6,79.14 45,78.75 45,66.75 43.5,65.25 43.5,58.75 40.5,55.75 37.25,55.75 v36,57
/RESET  (via drill 0.4)
  Top 0.5: IC1.4 28.78,72.25 v28.5,72.25 | v34.5,76.5 37.5,73.5 51,73.5 52.24,72.26 | 52.24,72.26 52.25,72.25 | 52.24,72.26 SV1.5
  Bottom 0.5: 29.2,74 29.25,74 | 29.2,74 R1.1 29.35,74.25 31,74.25 | D2.A 27.35,74 29.2,74 | C1.1 31.25,74.2 31.25,74.25 31,74.25 | D2.A 27,73.75 | D2.A 27,73.25 28,72.25 v28.5,72.25 | C1.1 31.25,74 | 31,74.25 C1.1 | 31.25,74 32,74 v34.5,76.5 | 31,74.25 31.25,74
/SS  (via drill 0.4)
  Top 0.5: IC1.44 35,73.66 35,74.5 28.25,81.25 v15.5,81.25 | IC2.16 9.72,76.47 10.75,77.5 13,77.5 13.25,77.25 v15.5,77.25
  Bottom 0.5: v15.5,77.25 v15.5,81.25
BUS_A  (via drill 0.4)
  Top 0.5: CON1.1 18.88,91.63 18.25,91 18.25,89.5 19.25,88.5 36.75,88.5 | 36.75,88.5 37.75,89.5 37.75,91 38.46,91.71 | 38.46,91.71 38.5,91.75 | 38.46,91.71 CON2.1 | 42,88.5 v43,87.5 | 36.75,88.5 42,88.5 | R15.1 57.6,86.75 49.75,86.75 48,88.5 42,88.5
  Bottom 0.5: IC9.6 43.34,87.17 v43,87.5 | IC3.7 19.05,84.69 18.25,85.5 18.25,91.25 18.75,91.75 18.79,91.71 CON1.1
BUS_B
  Bottom 0.5: CON1.2 19.9,89.1 20.5,88.5 22.75,88.5 | 22.75,88.5 39.5,88.5 | 39.5,88.5 44,88.5 | 44,88.5 44.5,88 44.5,85.75 44.6,85.64 IC9.7 | CON2.2 39.4,88.6 39.5,88.5 | IC3.6 22.21,85.97 22.75,86.5 22.75,88.5 | JP1.2 53.1,86.4 51,88.5 44,88.5
CAN_EN  (via drill 0.4)
  Top 0.5: IC1.23 35.11,58 37,58 v39,60 | v22.75,83.5 38.75,83.5 40.5,81.75 v40.5,81.25
  Bottom 0.5: R3.2 20.5,81.25 20.59,81.34 IC3.8 22.68,83.42 v22.75,83.5 | v39,60 40,61 40,66.25 42,68.25 42,76.75 40.5,78.25 v40.5,81.25
DE_RS485  (via drill 0.4)
  Top 0.5: IC1.21 29.5,57.98 29.5,56.5 30,56 36.75,56 v38,57.25
  Bottom 0.5: v38,57.25 40.25,57.25 42.25,59.25 42.25,65.5 44,67.25 44,78.25 43.34,78.92 IC9.3 43.34,81.92 42.75,82.5 40.25,82.5 39.75,83 R20.2
GATE_B  (via drill 0.4)
  Top 1: M1.G 26.24,39.26 v26.5,39
  Bottom 1: R_G_B.2 26.5,40.5 v26.5,39
GATE_G  (via drill 0.4)
  Top 1: M2.G 26.26,28.99 v26.75,28.5
  Bottom 1: R_G_G.2 26.5,30 26.5,28.75 v26.75,28.5
GATE_R  (via drill 0.4)
  Top 1: M3.G 26.26,18.24 v26.5,18
  Bottom 1: R_G_R.2 26.5,19.5 v26.5,18
GND  (via drill 0.4)
  Bottom 0.5: IC8.4 v26.25,26.25 | IC7.4 v26.25,36.75
  Bottom 0.7: IC6.4 25.41,46.5 v25.5,46.5
  other vias: 26.5,42.5 26.5,32.5 26.5,22
  pour Top (isolate 0.5, rank 2, no thermals): 26,47 36,47 41,52 58,52 59,51 59,17 57.75,15.75 45.25,15.75 42,12.5 42,10 40,8 22.5,8 21,9.5 21,16.5 23,16.5 24.5,18 24.5,45.5
  pour Bottom (isolate 0.3, no thermals): 25.5,44 30,44 30,42.5 29.5,42 25.5,42
  pour Bottom (isolate 0.3, no thermals): 25.5,33.5 30,33.5 30,32 29.5,31.5 25.5,31.5
  pour Bottom (isolate 0.3, no thermals): 25.5,23 30,23 30,21.5 29.5,21 25.5,21
  pour Bottom (isolate 0.3, rank 3, no thermals): 33,30 42,30 45.5,26.5 45.5,18.25 48,15.75 57.75,15.75 59,17 59,51 58,52 39,52 39,50 36,47 34,47 33,46
GND_EXT  (via drill 0.4)
  Top 0.4: 10.03,60.78 10,60.75 | CON5.G1 10.03,60.78 | OPTO1.4 10.98,61.73 10.03,60.78 | OPTO2.4 12.5,66.94 v12.5,66.5 12,66.5 11.18,67.33 IC4.P$7 | IC4.P$26 3.48,64.72 v3.75,65 3.75,65.25 3.62,65.38 IC4.P$25 | IC4.P$21 3.75,67.97 | IC4.P$18 3.33,69.92 3.75,69.5 3.75,67.97 | 3.75,67.97 4.97,67.97 v5.25,68.25
  Bottom 0.4: C34.2 13,62.25 11.5,60.75 10,60.75 10.03,60.78 CON5.G1 | 13,68.75 C16.2 13,67 v12.5,66.5
  Bottom 0.7: CON5.4 12.74,53.74 12.75,53.75 12.9,53.6 C33.2
  pour Bottom (isolate 0.2, rank 3, no thermals): 0.75,73 14.75,73 15.25,72.5 15.25,61.25 16.25,60.25 21.5,60.25 22.25,59.5 22.25,50 20.5,48.25 1.5,48.25 0.75,49
GNDIO  (via drill 0.4, 0.6)
  Top 0.4: IC1.6 29.75,69.02 v29.75,68.5 | IC1.39 35.99,69 v35.75,69
  Top 0.5: IC1.18 30.38,62.25 v31,62.25 | OPTO1.5 v18.25,61 | OPTO2.5 19.91,67.59 v20,67.5 | LED3.C 35.8,79.5 v34.75,79.5 | IC2.9 2.1,82.9 v2.5,82.5
  Bottom 0.5: IC9.5 42.06,84.19 42.5,83.75 48,83.75 48.2,83.95 | 48.2,83.95 48.25,84 | 48.2,83.95 C36.2 | IC3.2 12.05,84.69 12,84.75 C9.2 10.35,84.65 10.25,84.75 C12.2 | C6.2 6.75,75.25 4.5,77.5 3,77.5 2.25,78.25 | C11.2 2.25,79.25 | 18.25,63 C35.2 v18.25,61 | 18.25,69 C17.2 18.25,68.75 19.5,67.5 v20,67.5 | C8.2 2.5,80.75 v2.5,82.5
  other vias: 55,89.5 56.25,89.5 56.25,88.25 55,88.25
  pour Bottom (isolate 0.2, rank 6, no thermals): 0.75,99.25 59.25,99.25 59.25,53.25 37.75,53.25 37.75,50.75 23.25,50.75 23.25,59.75 21.75,61.25 16.5,61.25 16.25,61.5 16.25,72.75 15.25,73.75 0.75,73.75
  pour Top (isolate 0.2, rank 3, no thermals): 53.5,90 57,90 57,87.75 53.5,87.75
INT  (via drill 0.4)
  Top 0.5: IC2.12 4.64,75.86 v4.25,76.25 | IC1.11 25.11,68 v25,68
  Bottom 0.5: v4.25,76.25 4.25,75.75 6,74 18.5,74 19,73.5 22,73.5 25,70.5 v25,68
MISO  (via drill 0.4)
  Top 0.5: 24,79.25 11.25,79.25 8.5,76.5 8.5,74.5 8.47,74.5 IC2.15 | 24,79.25 24.05,79.25 | v32.25,71.25 32.05,71.25 IC1.2 29.75,73.55 29.75,77 27.5,79.25 24,79.25 | SV1.1 51.84,77.34 50.25,75.75 38,75.75 v37.5,76.25
  Bottom 0.5: v32.25,71.25 34.25,73.25 37.25,76.25 v37.5,76.25
MOSI  (via drill 0.4)
  Top 0.5: 24,80.25 11,80.25 7.25,76.5 7.25,74.5 7.23,74.52 IC2.14 | 24,80.25 24.18,80.25 | 24,80.25 27.75,80.25 30.75,77.25 30.75,73.68 IC1.1 31.79,73 v32.5,73 | SV1.4 55.55,74.8 56.75,76 56.75,78 55.75,79 51.75,79 49.5,76.75 38.5,76.75 v37.5,77.75
  Bottom 0.5: v32.5,73 33.75,74.25 37.25,77.75 v37.5,77.75
N$1
  Top 0.5: Q1.1 19.91,75 21.51,75 IC1.8
  Bottom 0.4: Q1.1 19.86,75 19.75,75 C3.1
N$2
  Top 0.5: Q1.2 24.74,75 24.75,75 24.75,72.89 IC1.7
  Bottom 0.4: Q1.2 24.74,75 24.75,75 C2.1
N$3  (via drill 0.4)
  Top 0.5: IC2.17 11,74.53 11,76 v11.5,76.5
  Bottom 0.5: D1.A 10.75,79.25 11,79 11,77.25 | 11,76.5 11,75.75 10.5,75.25 C6.1 9.25,75.25 | 11,76.5 11,77.25 | 9.25,77.25 R2.1 11,77.25 | 11,76.5 v11.5,76.5
N$4
  Top 0.5: IC2.8 3.37,85.87 5,87.5 5,88.25 4.75,88.5 3.75,88.5 3.72,88.47 Q2.2
  Bottom 0.5: Q2.2 3.71,88.5 3.75,88.5 3.75,86.6 C4.1
N$5
  Top 0.5: IC2.7 4.64,85.89 5.5,86.75 7,86.75 8.5,88.25 Q2.1
  Bottom 0.5: Q2.1 8.5,88.5 | Q2.1 | C5.1 8.5,86.6 Q2.1
N$6
  Top 0.5: IC1.37 39.75,70.5 45,70.5 45.75,69.75 | 45.75,69.75 45.8,69.75 R4.1 45.8,69.8 45.75,69.75
N$7  (via drill 0.4)
  Top 0.5: IC2.1 12.67,84.58 v13.75,83.5
  Bottom 0.5: IC3.1 13.82,83.42 v13.75,83.5
N$8  (via drill 0.4)
  Top 0.5: v13.5,87.25 12,87.25 11,86.25 11,84.5 10.99,84.51 IC2.2
  Bottom 0.5: IC3.4 13.52,87.23 v13.5,87.25
N$9
  Top 0.7: BEAD3.1 17.4,53.4 17.5,53.5 17.43,53.57 CON5.1
  Bottom 0.7: CON5.1 14.74,53.51 14.75,53.5 14.6,53.35 C33.1
N$10
  Top 0.5: IC1.36 39.89,69.5 43.75,69.5 45.25,68 46,68 45.95,68.05 R5.1 45.8,68.05 45.75,68
N$11
  Top 0.5: IC1.35 40.02,68.5 43,68.5 45.25,66.25 45.75,66.25 45.8,66.3 R6.1
N$12  (via drill 0.4)
  Top 0.5: R7.1 45.55,56.3 44.25,55 v44.25,54.75 | v47,64.75 46.75,65 41.97,65 IC1.34
  Bottom 0.5: v44.25,54.75 47,57.5 v47,64.75
N$13  (via drill 0.4)
  Top 0.5: R8.1 45.95,58.3 46,58.25 44.75,58.25 44.5,58 v44.5,56.5 | IC1.33 40.43,64 v46,64
  Bottom 0.5: v44.5,56.5 46,58 v46,64
N$14
  Top 0.5: 45.75,62.75 45.75,62.65 R9.1 45.9,62.5 | 45.9,62.5 46,62.5 | IC1.32 40.8,62.5 45.9,62.5
N$15
  Top 0.5: 46,60.5 45.9,60.5 R10.1 45.8,60.5 41.66,60.5 IC1.31
N$16
  Top 0.5: IC1.30 43,58.03 43,54.25 43.5,53.75 46,53.75 46,54.25 45.9,54.25 R11.1
N$17
  Top 0.5: R4.2 49.95,69.8 54.5,65.25 57.5,65.25 57.46,65.21 DIS1.10
N$18
  Top 0.5: R5.2 50.2,68.05 55.5,62.75 57.5,62.75 57.42,62.67 DIS1.9
N$19
  Top 0.5: R6.2 47.75,66.5 50.25,66.5 55.5,61.25 55.5,58.5 56.5,57.5 57.25,57.5 57.3,57.55 DIS1.7
N$20
  Top 0.5: 49.7,55.05 49.75,55 | 49.7,55.05 DIS1.5 | R7.2 48.45,56.3 49.7,55.05
N$21
  Top 0.5: 49.68,57.57 49.75,57.5 | 49.68,57.57 DIS1.4 | R8.2 48.95,58.3 49.68,57.57
N$22
  Top 0.5: DIS1.2 49.75,62.74 49.75,62.75 47.75,62.75 R9.2
N$23
  Top 0.5: R10.2 48.3,60.55 49.25,61.5 50.75,61.5 51.5,62.25 51.5,63.75 50,65.25 49.96,65.21 DIS1.1
N$24
  Top 0.5: R11.2 48.1,53.75 51.25,53.75 52.5,55 57.25,55 DIS1.6
N$25
  Top 0.4: IC4.P$16 1.02,71.22 0.75,71.5 0.75,72.5 1,72.75 3.75,72.75 7,69.5 7,63.25 6,62.25 6,60.5 9,57.5 13.25,57.5 14.75,56 CON5.2
N$26  (via drill 0.4)
  Top 0.4: IC4.P$17 3.92,70.58 4.75,69.75 v4.75,69.5
  Bottom 0.4: C13.1 5.25,71 4.75,70.5 v4.75,69.5
N$27
  Top 0.5: 55.52,84.5 55.5,84.5 | JP1.1 55.52,84.5 | R15.2 57.95,84.5 55.52,84.5
N$28
  pour Top (isolate 0.5, no thermals): 23,23.5 23,26 22,27 1.5,27 0.5,26 0.5,19 1.5,18 22,18 23,19
  pour Bottom (isolate 0.5, no thermals): 1,18.5 8.5,18.5 8.5,20.5 11,23 11,26 10.5,26.5 1,26.5 0.5,26 0.5,19
N$29
  Top 0.4: LED1.A R13.1
N$30
  Top 0.4: 19,57.25 R14.1 18.75,55.5 19,55.25 LED2.A
N$31
  Top 0.4: 20.75,53.25 LED1.C 20.75,52.25 20,51.5 11.75,51.5 3.75,59.5 3.75,63 4.75,64 4.75,66.5 4.58,66.67 IC4.P$23
N$32
  Top 0.4: 19,53.25 19,53.5 | 19,53.25 LED2.C | 19,53.25 19,52.5 18.75,52.25 12,52.25 4.5,59.75 4.5,62.75 5.5,63.75 5.5,66.75 4.92,67.33 IC4.P$22
N$33
  Top 0.4: IC4.P$1 11.07,63.42 11.5,63 13,63 13.01,63.01 OPTO1.3
N$34
  Top 0.4: IC4.P$5 10.97,66.03 11.5,65.5 11.5,64.5 11.75,64.25 13,64.25 13.03,64.28 OPTO1.2
N$36
  pour Top (isolate 0.5, no thermals): 23,39.5 23,46 22,47 1.5,47 0.5,46 0.5,39.5 1.5,38.5 22,38.5
  pour Bottom (isolate 0.5, no thermals): 1,38 8.5,38 8.5,40.5 11,43 11,46 10.5,46.5 1,46.5 0.5,46 0.5,38.5
N$37
  Top 0.5: LED3.A 36,77.5 34.65,77.5 R16.1
N$38
  pour Top (isolate 0.2, rank 3, no thermals): 12,99.25 12,85.75 14.5,83.25 50.75,83.25 52.25,84.75 52.25,99.25
N$40
  Top 0.4: IC4.P$15 3.62,71.88 6.25,69.25 6.25,63.5 5.25,62.5 5.25,60.25 9.5,56 12.75,56 12.74,56.01 CON5.3
N$42
  Top 0.4: IC4.P$13 11.03,71.22 12.12,70.14 OPTO2.2
N$43
  pour Bottom (isolate 0.5, no thermals): 23,43.5 24,43.5 24,42 25,41 25,40 23.5,40 23,40.5
N$44
  pour Bottom (isolate 0.3, no thermals): 23,22.5 24,22.5 24,20.5 24.5,20 25,20 25,19 23.5,19 23,19.5
N$45
  pour Bottom (isolate 0.3, no thermals): 24,33 24,31 24.5,30.5 25,30.5 25,29.5 23.5,29.5 23,30 23,33
N$46
  Top 0.4: IC4.P$14 11.12,71.88 12.25,73 14.25,73 15.5,71.75 15.5,69.5 14.75,68.75 13.25,68.75 13.13,68.86 | 13.13,68.86 13,69 | 13.13,68.86 OPTO2.3
N_B
  pour Bottom (isolate 0.5, no thermals): 1,28 8.5,28 8.5,30.5 11,33 11,36 10.5,36.5 1,36.5 0.5,36 0.5,28.5
  pour Top (isolate 0.5, no thermals): 23,34.5 23,36 22,37 1.5,37 0.5,36 0.5,29.5 1.5,28.5 22,28.5 23,29.5
PWM_B  (via drill 0.4)
  Top 0.5: IC1.16 27.25,61.39 v27.25,57.5
  Bottom 0.5: IC6.2 22.86,49.62 23.5,50.25 26,50.25 27.25,51.5 v27.25,57.5
PWM_G  (via drill 0.4)
  Top 0.5: IC1.14 26.25,62.65 v26.25,58.5
  Bottom 0.5: IC7.2 22.86,39.13 22,40 21,40 20.5,40.5 20.5,50 21.75,51.25 25.25,51.25 26.25,52.25 v26.25,58.5
PWM_R  (via drill 0.4)
  Top 0.5: IC1.13 25.25,62.78 v25.25,59.75
  Bottom 0.5: v25.25,59.75 25.25,53.25 24.25,52.25 21.5,52.25 19.5,50.25 19.5,32 22.75,28.75 22.86,28.64 22.86,26.89 IC8.2
RXD_AVR  (via drill 0.4)
  Top 0.5: IC1.9 25.38,70 24,70 20.5,66.5 17,66.5 16.5,66 16.5,63.5 17,63.01 OPTO1.6 22,63 23.25,61.75 23.25,58.5 27.75,54 40.5,54 v41.75,55.25
  Bottom 0.5: IC9.1 45.88,66.12 44.75,65 44.75,58.25 v41.75,55.25
SCK  (via drill 0.4)
  Top 0.5: v14.25,81.25 10.75,81.25 6,76.5 6,74.5 5.98,74.52 IC2.13 | v31.75,70.25 31.75,70.41 IC1.3 28.75,73.41 28.75,76.75 27.25,78.25 v14.25,78.25 | SV1.3 37.7,74.8 v37.5,75
  Bottom 0.5: v14.25,81.25 v14.25,78.25 | v31.75,70.25 32.75,70.25 v37.5,75
TXD_AVR  (via drill 0.4)
  Top 0.5: OPTO1.7 20.77,64.28 21.5,65 | 21.5,65 21.5,66.25 24.25,69 25.24,69 IC1.10 | v39.5,58.25 39.5,56.5 38,55 28,55 24.25,58.75 24.25,62.25 21.5,65
  Bottom 0.5: IC9.4 42.06,78.44 43,77.5 43,67.75 41,65.75 41,59.75 v39.5,58.25
USB_PWREN  (via drill 0.4)
  Top 0.5: IC1.42 34.25,70.65 v34.25,70.25 | OPTO2.6 21.11,68.86 v23,70.75
  Bottom 0.5: v34.25,70.25 30.75,66.75 24.5,66.75 23.75,67.5 23.75,70 v23,70.75
USB_TXDEN  (via drill 0.4)
  Top 0.5: IC1.12 25.14,64.61 v25,64.75 | OPTO2.7 20.64,70.14 v21.75,71.25
  Bottom 0.5: v25,64.75 22.75,67 22.75,69.25 21.75,70.25 v21.75,71.25
V+
  Bottom 0.7: C28.1 27.65,45.35 27.5,45.5 C27.1 27.5,45.25 27.25,45.5 23,45.5 | IC7.8 21.5,32.5 21.59,32.59 21.59,35 | 21.59,35 IC7.1 | C30.1 27.65,34.85 27.5,35 C29.1 27.35,35 22,35 | 22,35 21.59,35 | 22,35 22.15,34.85 | IC8.8 21.59,21.59 | 21.59,21.59 21.59,24.5 | 21.59,24.5 IC8.1 | 21.59,21.59 21.5,21.5 | C32.1 27.65,24.35 27.5,24.5 | 21.59,24.5 22,24.5 22.15,24.35 | 21.59,24.5 21.5,24.5 | 27.5,24.5 C31.1 | 21.59,24.5 27.5,24.5 | IC6.1 21.59,46.91 23,45.5 | 21.75,44.25 21.5,44 | 23,45.5 21.75,44.25 | IC6.8 21.59,44.09 21.75,44.25
  Bottom 1: C28.1 30.65,45.35 31.5,44.5 31.5,35 | 31.5,35 31.5,25 31,24.5 29.5,24.5 C32.1 | C30.1 29.5,35 31.5,35 | C20.+ 36.5,27.5 35.5,28.5 33.75,28.5 | 33.75,28.5 33.5,28.5 | 40.31,48.56 40.25,48.5 | 40.31,48.56 IC5.IN | 40.75,48.85 40.6,48.85 40.31,48.56 | 40.75,48.85 C18.1 | 40.75,48.85 40.75,48.75 40.5,48.5 35.25,48.5 33.75,47 33.75,28.5 | 33.75,28.5 33.75,28.25
  pour Bottom (isolate 0.5, rank 2, no thermals): 57.75,0.5 0.5,0.5 0.5,17 27.5,17 30.5,20 30.5,25.5 33.5,28.5 41.5,28.5 44,26 44,17.5 47.5,14 58.5,14 59,13.5 59,1.75
  pour Top (isolate 0.5, rank 3, no thermals): 1.5,16.5 1,16 1,2 2,1 58.25,1 59,1.75 59,13.5 58.5,14 46,14 44,12 44,9.5 41,6.5 21.5,6.5 19,9 19,16.5
  pour Bottom (isolate 0.5, rank 2, no thermals): 14.5,42.5 13.5,42.5 11.5,40.5 11.5,38 12.5,37 12.5,31.5 11.5,30.5 11.5,28 12.5,27 12.5,22 11.5,21 11.5,16 15,16 15,42
  pour Bottom (isolate 0.3, no thermals): 21.5,47 23,45.5 21.5,44
  pour Bottom (isolate 0.3, no thermals): 21.5,36.5 23,35 21.5,33.5
  pour Bottom (isolate 0.3, no thermals): 21.5,26 23,24.5 21.5,23
VCC  (via drill 0.4)
  Top 0.4: IC1.5 30.4,69.5 v30.75,69.5 | IC1.38 36.5,68.37 v36.5,68
  Top 0.5: OPTO2.8 v17.5,72.25 | IC2.18 12.26,75.76 v12.75,76.25 | IC1.38 39.75,71.62 39.75,72 | IC1.17 29.75,62.76 v29.75,63.25 | OPTO1.8 20.2,65.55 arc-90 v20.25,65.5 | IC1.5 28.65,71.25 27.75,71.25 26.5,72.5
  Top 1: 57.3,60.2 57.25,60.25 | 57.3,60.2 DIS1.8 | 57.3,60.2 58.75,58.75 58.75,53.75 57.5,52.5 38.75,52.5 37.5,51.25 37.5,44.5 38.5,43.5 40,43.5 40.25,43.75 40.31,43.69 IC5.OUT
  Bottom 0.5: IC9.8 47.9,85.6 48,85.5 | IC3.3 12.29,85.97 12,86.25 C9.1 10.35,86.35 10.25,86.25 C12.1 v10.25,91.5 | 48,85.5 48.05,85.55 C36.1 | 48,85.5 48.1,85.6 R19.2 51.15,85.6 51.75,85 51.75,81.25 54.75,78.75 54.75,77.25 54.72,77.28 SV1.2 | R2.2 7,77.25 6.5,77.75 6.5,79 6.55,79.05 D1.C 6.3,79 3.75,79 3.75,78.85 C11.1 4,78.75 4,81 3.75,81.25 C8.1 3.75,80.85 3.75,81 11.5,81 12.75,79.75 v12.75,76.25 | 29.15,75.6 29.25,75.5 | 29.15,75.6 R1.2 | 29.15,75.6 29,75.75 29,76.75 28.7,77.05 D2.C v27,75.75 | 18.25,70.5 C17.1 18.25,71.5 v17.5,72.25 | C10.1 30,70.25 v30.75,69.5 | C38.1 37.37,68.87 v36.5,68 | C37.1 29.35,61 29.25,61 29.25,62.75 v29.75,63.25 24.5,63.25 21.75,66 | v17.5,72.25 19.75,72.25 20.75,71.25 20.75,69.5 21.75,68.5 21.75,66 | C35.1 18.25,64.75 19,65.5 v20.25,65.5 21.25,65.5 21.75,66
  Bottom 1: C7.1 C19.1 37.5,44 38,43.5 IC5.OUT
  other vias: 51,81.5 51,80.5
  pour Top (isolate 0.2, rank 6, no thermals): 0.75,99.25 0.75,73.75 15.25,73.75 16.25,72.75 16.25,61.5 16.5,61.25 21.75,61.25 23.25,59.75 23.25,50.75 35.25,50.75 37.75,53.25 59.25,53.25 59.25,99.25 0.75,99.25 0.75,99
  pour Bottom (isolate 0.2, no thermals): 50.5,82 51.75,82 51.75,81.25 53.25,80 50.5,80
VCC_EXT  (via drill 0.4)
  Top 0.4: OPTO1.1 13.06,65.81 v13.75,66.5 | OPTO2.1 v13.75,72 | R13.2 20.65,58.75 19,58.75 R14.2 17.85,58.85 17.25,58.25 BEAD3.2 17.25,55 | IC4.P$4 7.88,65.38 7.75,65.5 | IC4.P$20 0.88,68.62 0.75,68.5 0.75,62.25 1.25,61.75 v2.25,61.75
  Bottom 0.4: C34.1 13,65.75 v13.75,66.5 14.5,67.25 14.5,69.75 14,70.25 13.25,70.25 | 13.25,70.25 13.1,70.25 C16.1 | v13.75,72 13.25,71.5 13.25,70.25 | C15.1 4.15,61.15 4.25,61.25 | 4.25,61.25 C14.1 | v2.25,61.75 3.75,61.75 4.25,61.25
  pour Top (isolate 0.2, rank 3, no thermals): 0.75,73 14.75,73 15.25,72.5 15.25,61.25 16.25,60.25 21.5,60.25 22.25,59.5 22.25,50 20.5,48.25 1.5,48.25 0.75,49